# EAGLE schematic Windturbine1 (EAGLE 9.1.3)
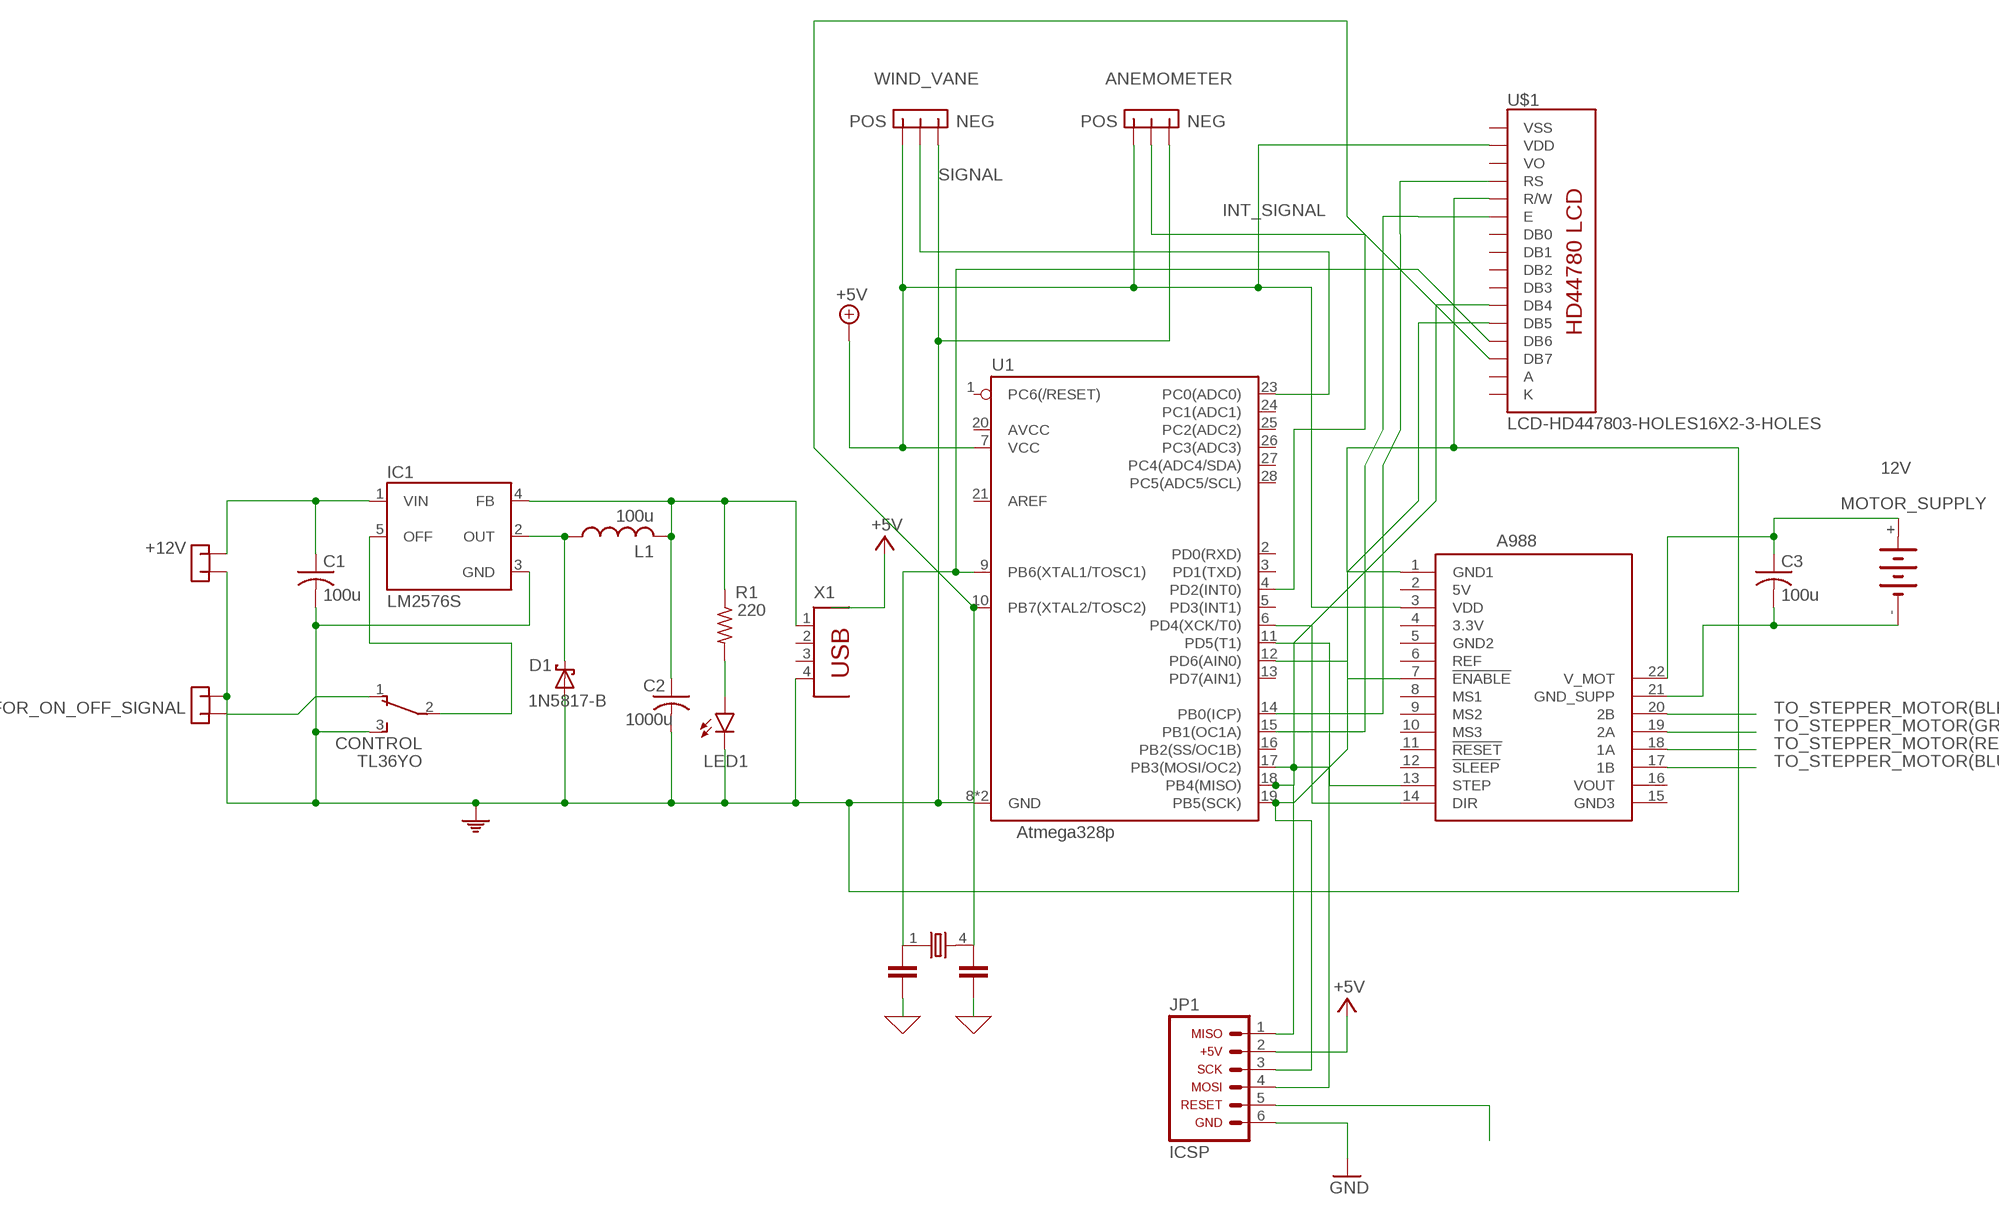
[diagram p0: schematic, sheet 1]

## Parts
+12V  -CON2  [CON2]
A988  POLOLU_1183  [POLOLU_1183]
ANEMOMETER  -CON3  [CON3]
C1  100u  C-US050-045X075  [C050-045X075]
C2  1000u  C-US050-045X075  [C050-045X075]
C3  100u  C-US050-045X075  [C050-045X075]
CONTROL  TL36YO  [TL3XYO]
D1  1N5817-B  [DO41-7.6]
FOR_ON_OFF_SIGNAL  -CON2  [CON2]
IC1  LM2576S  [TO263-5]
JP1  ARDUINO_CONN-ICSP  [CONN-2X03]
L1  100u  L-USL2012C  [L2012C]
LED1  LED  [SMARTLED-TTW]
MOTOR_SUPPLY  12V  3V11R  [3V11R]
R1  220  R-US_R0402  [R0402]
U1  Atmega328p  ATMEGA328P_PDIP  [DIP28]
U$1  LCD-HD447803-HOLES16X2-3-HOLES  [LCD-16X2-3HOLES]
U$2  90SMX  [9XSMX]
WIND_VANE  -CON3  [CON3]
X1  PN61729  [PN61729]

## Nets
+5V: JP1.2
GND: JP1.6
INT_SIGNAL: ANEMOMETER.P$2 U1.4(PD2(INT0))
N$1: A988.14(DIR) U1.6(PD4(XCK/T0))
N$2: A988.22(V_MOT) C3.1 MOTOR_SUPPLY.+
N$3: A988.13(STEP) U1.11(PD5(T1))
N$4: A988.7(!ENABLE) U1.12(PD6(AIN0))
N$5: +12V.P$1 C1.1 IC1.1(VIN)
N$6: CONTROL.1(O) FOR_ON_OFF_SIGNAL.P$2
N$7: CONTROL.2(P) IC1.5(OFF)
N$8: D1.C IC1.2(OUT) L1.1
N$9: C2.1 IC1.4(FB) L1.2 R1.1 X1.1
N$10: LED1.A@1(ANODE) R1.2
N$11: A988.21(GND_SUPP) C3.2 MOTOR_SUPPLY.-
N$12: U1.14(PB0(ICP)) U$1.4(RS)
N$13: U1.15(PB1(OC1A)) U$1.6(E)
N$14: JP1.1 JP1.4 U1.17(PB3(MOSI/OC2)) U1.18(PB4(MISO)) U$1.11(DB4)
N$16: U1.9(PB6(XTAL1/TOSC1)) U$1.13(DB6) U$2.1
N$17: U1.10(PB7(XTAL2/TOSC2)) U$1.14(DB7) U$2.4
N$20: JP1.3 U1.19(PB5(SCK)) U$1.12(DB5)
N$21: JP1.5
NEG: +12V.P$2 A988.1(GND1) ANEMOMETER.P$1 C1.2 C2.2 CONTROL.3(S) D1.A FOR_ON_OFF_SIGNAL.P$1 IC1.3(GND) LED1.C@1(CATHODE) U1.8(GND) U1.22(GND) U$1.5(R/W) WIND_VANE.P$1 X1.4 ; supply symbol labelled PE
POS: A988.3(VDD) ANEMOMETER.P$3 U1.7(VCC) U$1.2(VDD) WIND_VANE.P$3 ; supply symbol labelled +5V
SIGNAL: U1.23(PC0(ADC0)) WIND_VANE.P$2
TO_STEPPER_MOTOR(BLK): A988.20(2B)
TO_STEPPER_MOTOR(BLU): A988.17(1B)
TO_STEPPER_MOTOR(GRN): A988.19(2A)
TO_STEPPER_MOTOR(RED): A988.18(1A)
Unconnected: A988.2(5V) A988.4(3.3V) A988.5(GND2) A988.6(REF) A988.8(MS1) A988.9(MS2) A988.10(MS3) A988.11(!RESET) A988.12(!SLEEP) A988.15(GND3) A988.16(VOUT) U1.1(PC6(/RESET)) U1.2(PD0(RXD)) U1.3(PD1(TXD)) U1.5(PD3(INT1)) U1.13(PD7(AIN1)) U1.16(PB2(SS/OC1B)) U1.20(AVCC) U1.21(AREF) U1.24(PC1(ADC1)) U1.25(PC2(ADC2)) U1.26(PC3(ADC3)) U1.27(PC4(ADC4/SDA)) U1.28(PC5(ADC5/SCL)) U$1.3(VO) U$1.7(DB0) U$1.8(DB1) U$1.9(DB2) U$1.10(DB3) X1.2 X1.3

## Power pins joined to a net without a drawn wire
A: U$1.15(A)
K: U$1.16(K)
VSS: U$1.1(VSS)

## Library data of the parts
+12V FOR_ON_OFF_SIGNAL = tango:-CON2
A988 = pololu:POLOLU_1183: Pololu 1183 Carrier board or breakout board for Allegro?s A4988 DMOS Microstepping Driver with Translator and Overcurrent Protection. The board has two voltage regulators (5 V and 3.3 V), eliminating the need for separate logic and motor supplies. The driver features adjustable current limiting, overcurrent protection, and five different microstep resolutions. It operates from 8 ? 35 V and can deliver up to 2 A per coil. - Simple step and direction control interface - Five different step resolutions - Adjustable current control lets you set the maximum current output with a potentiometer - Intelligent chopping control that automatically selects the correct current decay mode - Over-temperature thermal shutdown, under-voltage lockout, and crossover-current protection - Short-to-ground and shorted-load protection Link to product page <http://www.pololu.com/catalog/product/1183>
ANEMOMETER WIND_VANE = tango:-CON3
C1-C3 = resistor:C-US: CAPACITOR, American symbol
CONTROL = switch:TL36YO: TINY SWITCH ON - ON Source: http://www2.produktinfo.conrad.com/datenblaetter/700000-724999/705152-da-01-de-Subminiaturschalter_TL_36YO.pdf
D1 = _mod_diode:1N581*: 1.0A SCHOTTKY BARRIER RECTIFIER Source: http://www.diodes.com/datasheets/ds23001.pdf
IC1 = v-reg-3:LM2576: National Semiconductor <http://www.national.com> 3.0A "Simple Switcher"(c) 52kHz, Vout 1.23-37V (HV: 57V), Vin 40V (HV: 60V), 50µA standby current
JP1 = arduino_jw:ARDUINO_CONN-ICSP: Arduino ICSP I/O Header This is the ICSP I/O header on the Arduino Uno R3. This connector is labeled with the following pin assignments: MISO +5V SCK MOSI RESET GND NOTE: Be sure you install this connector with the correct orientation on your PCB layout. Pin 1 has a square pad to assist with orientation.
L1 = resistor:L-US: INDUCTOR, American symbol
LED1 = tango:LED: LED OSRAM: - CHIPLED LG R971, LG N971, LY N971, LG Q971, LY Q971, LO R971, LY R971 LH N974, LH R974 LS Q976, LO Q976, LY Q976 LO Q996 - Hyper CHIPLED LW Q18S LB Q993, LB Q99A, LB R99A - SideLED LS A670, LO A670, LY A670, LG A670, LP A670 LB A673, LV A673, LT A673, LW A673 LH A674 LY A675 LS A676, LA A676, LO A676, LY A676, LW A676 LS A679, LY A679, LG A679 - Hyper Micro SIDELED® LS Y876, LA Y876, LO Y876, LY Y876 LT Y87S - SmartLED LW L88C, LW L88S LB L89C, LB L89S, LG L890 LS L89K, LO L89K, LY L89K LS L896, LA L896, LO L896, LY L896 - TOPLED LS T670, LO T670, LY T670, LG T670, LP T670 LSG T670, LSP T670, LSY T670, LOP T670, LYG T670 LG T671, LOG T671, LSG T671 LB T673, LV T673, LT T673, LW T673 LH T674 LS T676, LA T676, LO T676, LY T676, LB T676, LH T676, LSB T676, LW T676 LB T67C, LV T67C, LT T67C, LS T67K, LO T67K, LY T67K, LW E67C LS E67B, LA E67B, LO E67B, LY E67B, LB E67C, LV E67C, LT E67C LW T67C LS T679, LY T679, LG T679 LS T770, LO T770, LY T770, LG T770, LP T770 LB T773, LV T773, LT T773, LW T773 LH T774 LS E675, LA E675, LY E675, LS T675 LS T776, LA T776, LO T776, LY T776, LB T776 LHGB T686 LT T68C, LB T68C - Hyper Mini TOPLED® LB M676 - Mini TOPLED Santana® LG M470 LS M47K, LO M47K, LY M47K Source: http://www.osram.convergy.de - LUMILED® LXK2-PW12-R00, LXK2-PW12-S00, LXK2-PW14-U00, LXK2-PW14-V00 LXK2-PM12-R00, LXK2-PM12-S00, LXK2-PM14-U00 LXK2-PE12-Q00, LXK2-PE12-R00, LXK2-PE12-S00, LXK2-PE14-T00, LXK2-PE14-U00 LXK2-PB12-K00, LXK2-PB12-L00, LXK2-PB12-M00, LXK2-PB14-N00, LXK2-PB14-P00, LXK2-PB14-Q00 LXK2-PR12-L00, LXK2-PR12-M00, LXK2-PR14-Q00, LXK2-PR14-R00 LXK2-PD12-Q00, LXK2-PD12-R00, LXK2-PD12-S00 LXK2-PH12-R00, LXK2-PH12-S00 LXK2-PL12-P00, LXK2-PL12-Q00, LXK2-PL12-R00 Source: www.luxeon.com
MOTOR_SUPPLY = battery:3V11R: NC ACCU Varta
R1 = resistor:R-US_: RESISTOR, American symbol
U1 = SparkFun-IC-Microcontroller:ATMEGA328P_PDIP: Atmel 328P Through hole ATMEGA328P uC used in the Arduino 32kb flash, 1k EEPROM, 2k SRAM Datasheet <http://www.sparkfun.com/datasheets/Components/SMD/ATMega328.pdf> SparkFun Products Storefront component: AVR 28 Pin 20MHz 32K 6A/D - ATMega328P <https://www.sparkfun.com/products/9061> (COM-09061) SparkFun Simon Says - Through-Hole Soldering Kit <https://www.sparkfun.com/products/10547> (KIT-10547) SparkFun Learn to Solder - Simon Says <https://www.sparkfun.com/products/13708> (KIT-13708) SparkFun BigTime Watch Kit <https://www.sparkfun.com/products/11734> (KIT-11734) SparkFun ClockIt <https://www.sparkfun.com/products/10930> (KIT-10930) SparkFun Serial Enabled LCD Kit <https://www.sparkfun.com/products/10097> (LCD-10097) SparkFun Simon Tilts - Through Hole Soldering Kit <https://www.sparkfun.com/products/12634> (KIT-12634) SparkFun Frequency Counter Kit <https://www.sparkfun.com/products/10140> (KIT-10140) FabFM Radio Kit <https://www.sparkfun.com/products/11043> (KIT-11043) SparkFun Binary Blaster Kit <https://www.sparkfun.com/products/12037> (KIT-12037) SparkFun Metro-Gnome <https://www.sparkfun.com/products/9236> (KIT-09236) ATmega328 with Arduino Optiboot (Uno) <https://www.sparkfun.com/products/10524> (DEV-10524); PROD_ID: IC-09136; VALUE: 328P
U$1 = HD44780LCD:LCD-HD44780
U$2 = crystal:90SMX
X1 = tango:PN61729: BERG USB connector